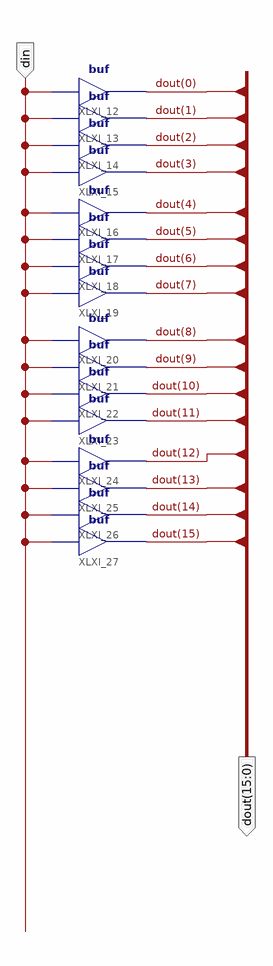
[diagram p0: schematic sheet 1]
// Xilinx ISE schematic broadcast.sch (spartan6) as structural Verilog: 16 symbols, 2 ports
module broadcast (
  input  din,
  output [15:0] dout
);

  buf XLXI_12 (dout[0], din);
  buf XLXI_13 (dout[1], din);
  buf XLXI_14 (dout[2], din);
  buf XLXI_15 (dout[3], din);
  buf XLXI_16 (dout[4], din);
  buf XLXI_17 (dout[5], din);
  buf XLXI_18 (dout[6], din);
  buf XLXI_19 (dout[7], din);
  buf XLXI_20 (dout[8], din);
  buf XLXI_21 (dout[9], din);
  buf XLXI_22 (dout[10], din);
  buf XLXI_23 (dout[11], din);
  buf XLXI_24 (dout[12], din);
  buf XLXI_25 (dout[13], din);
  buf XLXI_26 (dout[14], din);
  buf XLXI_27 (dout[15], din);
endmodule
